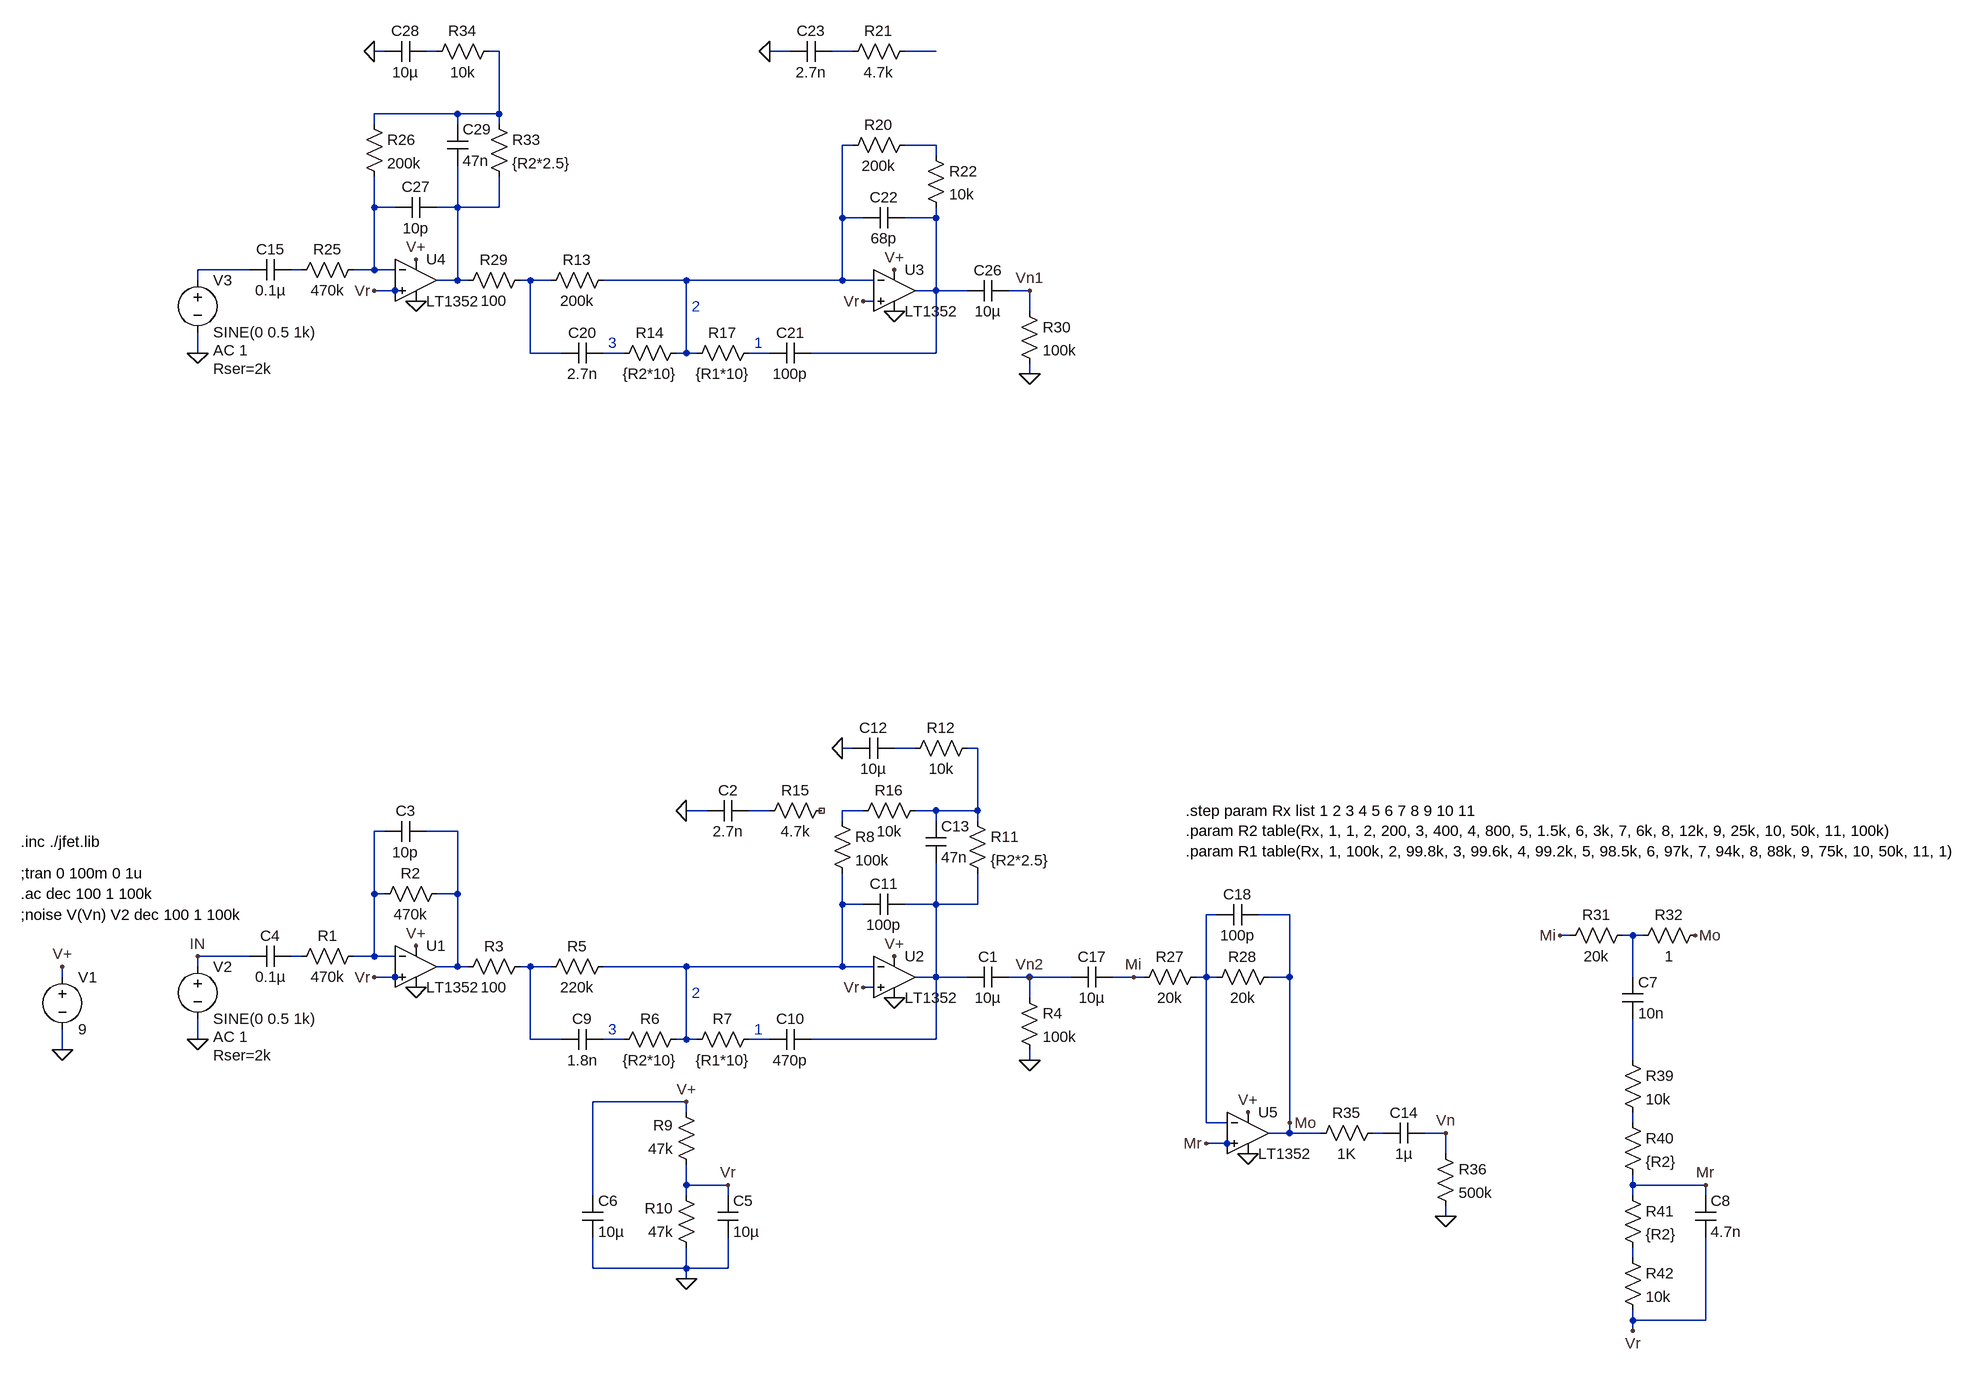
[diagram p0: schematic CB_BGP_V0.asc]
CB_BGP_V0.asc, the LTspice schematic file:
Version 4
SHEET 1 5112 4608
WIRE 880 -1296 864 -1296
WIRE 960 -1296 944 -1296
WIRE 1056 -1296 1040 -1296
WIRE 1504 -1296 1472 -1296
WIRE 1600 -1296 1568 -1296
WIRE 1728 -1296 1680 -1296
WIRE 992 -1200 864 -1200
WIRE 1056 -1200 1056 -1296
WIRE 1056 -1200 992 -1200
WIRE 864 -1184 864 -1200
WIRE 992 -1184 992 -1200
WIRE 1056 -1184 1056 -1200
WIRE 1600 -1152 1584 -1152
WIRE 1728 -1152 1680 -1152
WIRE 1728 -1136 1728 -1152
WIRE 864 -1056 864 -1104
WIRE 896 -1056 864 -1056
WIRE 992 -1056 992 -1120
WIRE 992 -1056 960 -1056
WIRE 1056 -1056 1056 -1104
WIRE 1056 -1056 992 -1056
WIRE 1584 -1040 1584 -1152
WIRE 1616 -1040 1584 -1040
WIRE 1728 -1040 1728 -1056
WIRE 1728 -1040 1680 -1040
WIRE 672 -960 592 -960
WIRE 752 -960 736 -960
WIRE 864 -960 864 -1056
WIRE 864 -960 832 -960
WIRE 896 -960 864 -960
WIRE 592 -944 592 -960
WIRE 992 -944 992 -1056
WIRE 992 -944 960 -944
WIRE 1008 -944 992 -944
WIRE 1104 -944 1088 -944
WIRE 1136 -944 1104 -944
WIRE 1344 -944 1216 -944
WIRE 1584 -944 1584 -1040
WIRE 1584 -944 1344 -944
WIRE 1632 -944 1584 -944
WIRE 896 -928 864 -928
WIRE 912 -928 896 -928
WIRE 1728 -928 1728 -1040
WIRE 1728 -928 1696 -928
WIRE 1776 -928 1728 -928
WIRE 1872 -928 1840 -928
WIRE 1632 -912 1616 -912
WIRE 1872 -896 1872 -928
WIRE 592 -832 592 -864
WIRE 1104 -832 1104 -944
WIRE 1152 -832 1104 -832
WIRE 1248 -832 1216 -832
WIRE 1344 -832 1344 -944
WIRE 1344 -832 1328 -832
WIRE 1360 -832 1344 -832
WIRE 1472 -832 1440 -832
WIRE 1728 -832 1728 -928
WIRE 1728 -832 1536 -832
WIRE 1872 -800 1872 -816
WIRE 1600 -224 1584 -224
WIRE 1696 -224 1664 -224
WIRE 1792 -224 1776 -224
WIRE 1376 -128 1344 -128
WIRE 1472 -128 1440 -128
WIRE 1616 -128 1584 -128
WIRE 1728 -128 1696 -128
WIRE 1792 -128 1792 -224
WIRE 1792 -128 1728 -128
WIRE 1584 -112 1584 -128
WIRE 1728 -112 1728 -128
WIRE 1792 -112 1792 -128
WIRE 880 -96 864 -96
WIRE 992 -96 944 -96
WIRE 864 0 864 -96
WIRE 880 0 864 0
WIRE 992 0 992 -96
WIRE 992 0 960 0
WIRE 1584 16 1584 -32
WIRE 1616 16 1584 16
WIRE 1728 16 1728 -48
WIRE 1728 16 1680 16
WIRE 1792 16 1792 -32
WIRE 1792 16 1728 16
WIRE 2160 32 2144 32
WIRE 2272 32 2224 32
WIRE 2704 64 2688 64
WIRE 2800 64 2784 64
WIRE 2816 64 2800 64
WIRE 672 96 592 96
WIRE 752 96 736 96
WIRE 864 96 864 0
WIRE 864 96 832 96
WIRE 896 96 864 96
WIRE 592 112 592 96
WIRE 992 112 992 0
WIRE 992 112 960 112
WIRE 1008 112 992 112
WIRE 1104 112 1088 112
WIRE 1136 112 1104 112
WIRE 1344 112 1216 112
WIRE 1584 112 1584 16
WIRE 1584 112 1344 112
WIRE 1632 112 1584 112
WIRE 384 128 384 112
WIRE 896 128 864 128
WIRE 912 128 896 128
WIRE 1728 128 1728 16
WIRE 1728 128 1696 128
WIRE 1776 128 1728 128
WIRE 1872 128 1840 128
WIRE 1936 128 1872 128
WIRE 2032 128 2000 128
WIRE 2048 128 2032 128
WIRE 2144 128 2144 32
WIRE 2144 128 2128 128
WIRE 2160 128 2144 128
WIRE 2272 128 2272 32
WIRE 2272 128 2240 128
WIRE 2800 128 2800 64
WIRE 1632 144 1616 144
WIRE 1872 160 1872 128
WIRE 592 224 592 192
WIRE 1104 224 1104 112
WIRE 1152 224 1104 224
WIRE 1248 224 1216 224
WIRE 1344 224 1344 112
WIRE 1344 224 1328 224
WIRE 1360 224 1344 224
WIRE 1472 224 1440 224
WIRE 1728 224 1728 128
WIRE 1728 224 1536 224
WIRE 384 240 384 208
WIRE 1872 256 1872 240
WIRE 2800 256 2800 192
WIRE 1344 320 1200 320
WIRE 1344 336 1344 320
WIRE 2144 352 2144 128
WIRE 2176 352 2144 352
WIRE 2272 352 2272 128
WIRE 2800 352 2800 336
WIRE 2272 368 2272 352
WIRE 2272 368 2240 368
WIRE 2320 368 2272 368
WIRE 2416 368 2400 368
WIRE 2512 368 2480 368
WIRE 2176 384 2144 384
WIRE 2192 384 2176 384
WIRE 2512 400 2512 368
WIRE 1344 448 1344 416
WIRE 1408 448 1344 448
WIRE 2800 448 2800 432
WIRE 2912 448 2800 448
WIRE 1200 464 1200 320
WIRE 1344 464 1344 448
WIRE 1408 464 1408 448
WIRE 2800 464 2800 448
WIRE 2912 464 2912 448
WIRE 2512 496 2512 480
WIRE 2800 560 2800 544
WIRE 1200 576 1200 528
WIRE 1344 576 1344 544
WIRE 1344 576 1200 576
WIRE 1408 576 1408 528
WIRE 1408 576 1344 576
WIRE 1344 592 1344 576
WIRE 2800 656 2800 640
WIRE 2912 656 2912 528
WIRE 2912 656 2800 656
WIRE 2800 672 2800 656
FLAG 592 224 0
FLAG 1664 96 V+
FLAG 2512 496 0
FLAG 2512 368 Vn
FLAG 2208 336 V+
FLAG 384 112 V+
FLAG 384 240 0
FLAG 2144 384 Mr
FLAG 2032 128 Mi
FLAG 2896 64 Mo
FLAG 2688 64 Mi
FLAG 2912 448 Mr
FLAG 2800 672 Vr
FLAG 1664 160 0
FLAG 2208 400 0
FLAG 2272 352 Mo
FLAG 1344 320 V+
FLAG 1344 592 0
FLAG 1408 448 Vr
FLAG 1616 144 Vr
FLAG 1584 -224 0
FLAG 1344 -128 0
FLAG 928 80 V+
FLAG 928 144 0
FLAG 592 96 IN
FLAG 864 128 Vr
FLAG 1872 256 0
FLAG 592 -832 0
FLAG 1664 -960 V+
FLAG 1664 -896 0
FLAG 1616 -912 Vr
FLAG 928 -976 V+
FLAG 928 -912 0
FLAG 864 -928 Vr
FLAG 1872 -800 0
FLAG 864 -1296 0
FLAG 1472 -1296 0
FLAG 1872 -928 Vn1
FLAG 1872 128 Vn2
SYMBOL voltage 384 112 R0
WINDOW 123 0 0 Left 2
WINDOW 39 0 0 Left 2
SYMATTR InstName V1
SYMATTR Value 9
SYMBOL voltage 592 96 R0
WINDOW 123 24 124 Left 2
WINDOW 39 24 152 Left 2
SYMATTR Value2 AC 1
SYMATTR SpiceLine Rser=2k
SYMATTR InstName V2
SYMATTR Value SINE(0 0.5 1k)
SYMBOL cap 736 80 R90
WINDOW 0 0 32 VBottom 2
WINDOW 3 32 32 VTop 2
SYMATTR InstName C4
SYMATTR Value 0.1µ
SYMBOL cap 2480 352 R90
WINDOW 0 0 32 VBottom 2
WINDOW 3 32 32 VTop 2
SYMATTR InstName C14
SYMATTR Value 1µ
SYMBOL res 2416 352 R90
WINDOW 0 0 56 VBottom 2
WINDOW 3 32 56 VTop 2
SYMATTR InstName R35
SYMATTR Value 1K
SYMBOL res 2496 384 R0
SYMATTR InstName R36
SYMATTR Value 500k
SYMBOL res 2144 112 R90
WINDOW 0 0 56 VBottom 2
WINDOW 3 32 56 VTop 2
SYMATTR InstName R27
SYMATTR Value 20k
SYMBOL res 2256 112 R90
WINDOW 0 0 56 VBottom 2
WINDOW 3 32 56 VTop 2
SYMATTR InstName R28
SYMATTR Value 20k
SYMBOL cap 2000 112 R90
WINDOW 0 0 32 VBottom 2
WINDOW 3 32 32 VTop 2
SYMATTR InstName C17
SYMATTR Value 10µ
SYMBOL res 2800 48 R90
WINDOW 0 0 56 VBottom 2
WINDOW 3 32 56 VTop 2
SYMATTR InstName R31
SYMATTR Value 20k
SYMBOL res 2912 48 R90
WINDOW 0 0 56 VBottom 2
WINDOW 3 32 56 VTop 2
SYMATTR InstName R32
SYMATTR Value 1
SYMBOL cap 2784 128 R0
SYMATTR InstName C7
SYMATTR Value 10n
SYMBOL res 2784 240 R0
SYMATTR InstName R39
SYMATTR Value 10k
SYMBOL res 2784 336 R0
SYMATTR InstName R40
SYMATTR Value {R2}
SYMBOL res 2784 448 R0
SYMATTR InstName R41
SYMATTR Value {R2}
SYMBOL res 2784 544 R0
SYMATTR InstName R42
SYMATTR Value 10k
SYMBOL cap 2896 464 R0
SYMATTR InstName C8
SYMATTR Value 4.7n
SYMBOL Opamps\\LT1352 1664 64 R0
SYMATTR InstName U2
SYMBOL Opamps\\LT1352 2208 304 R0
SYMATTR InstName U5
SYMBOL cap 2224 16 R90
WINDOW 0 0 32 VBottom 2
WINDOW 3 32 32 VTop 2
SYMATTR InstName C18
SYMATTR Value 100p
SYMBOL res 1232 96 R90
WINDOW 0 0 56 VBottom 2
WINDOW 3 32 56 VTop 2
SYMATTR InstName R5
SYMATTR Value 220k
SYMBOL res 1344 208 R90
WINDOW 0 0 56 VBottom 2
WINDOW 3 32 56 VTop 2
SYMATTR InstName R6
SYMATTR Value {R2*10}
SYMBOL res 1456 208 R90
WINDOW 0 0 56 VBottom 2
WINDOW 3 32 56 VTop 2
SYMATTR InstName R7
SYMATTR Value {R1*10}
SYMBOL res 1360 432 R180
WINDOW 0 36 76 Left 2
WINDOW 3 36 40 Left 2
SYMATTR InstName R9
SYMATTR Value 47k
SYMBOL res 1360 560 R180
WINDOW 0 36 76 Left 2
WINDOW 3 36 40 Left 2
SYMATTR InstName R10
SYMATTR Value 47k
SYMBOL cap 1392 464 R0
SYMATTR InstName C5
SYMATTR Value 10µ
SYMBOL cap 1184 464 R0
SYMATTR InstName C6
SYMATTR Value 10µ
SYMBOL cap 1216 208 R90
WINDOW 0 0 32 VBottom 2
WINDOW 3 32 32 VTop 2
SYMATTR InstName C9
SYMATTR Value 1.8n
SYMBOL cap 1536 208 R90
WINDOW 0 0 32 VBottom 2
WINDOW 3 32 32 VTop 2
SYMATTR InstName C10
SYMATTR Value 470p
SYMBOL cap 1680 0 R90
WINDOW 0 0 32 VBottom 2
WINDOW 3 32 32 VTop 2
SYMATTR InstName C11
SYMATTR Value 100p
SYMBOL res 1568 -128 R0
SYMATTR InstName R8
SYMATTR Value 100k
SYMBOL res 1776 -128 R0
SYMATTR InstName R11
SYMATTR Value {R2*2.5}
SYMBOL res 1792 -240 R90
WINDOW 0 0 56 VBottom 2
WINDOW 3 32 56 VTop 2
SYMATTR InstName R12
SYMATTR Value 10k
SYMBOL cap 1664 -240 R90
WINDOW 0 0 32 VBottom 2
WINDOW 3 32 32 VTop 2
SYMATTR InstName C12
SYMATTR Value 10µ
SYMBOL cap 1712 -112 R0
SYMATTR InstName C13
SYMATTR Value 47n
SYMBOL res 1568 -144 R90
WINDOW 0 0 56 VBottom 2
WINDOW 3 32 56 VTop 2
SYMATTR InstName R15
SYMATTR Value 4.7k
SYMBOL cap 1440 -144 R90
WINDOW 0 0 32 VBottom 2
WINDOW 3 32 32 VTop 2
SYMATTR InstName C2
SYMATTR Value 2.7n
SYMBOL res 1712 -144 R90
WINDOW 0 0 56 VBottom 2
WINDOW 3 32 56 VTop 2
SYMATTR InstName R16
SYMATTR Value 10k
SYMBOL res 848 80 R90
WINDOW 0 0 56 VBottom 2
WINDOW 3 32 56 VTop 2
SYMATTR InstName R1
SYMATTR Value 470k
SYMBOL res 976 -16 R90
WINDOW 0 0 56 VBottom 2
WINDOW 3 32 56 VTop 2
SYMATTR InstName R2
SYMATTR Value 470k
SYMBOL Opamps\\LT1352 928 48 R0
SYMATTR InstName U1
SYMBOL res 1104 96 R90
WINDOW 0 0 56 VBottom 2
WINDOW 3 32 56 VTop 2
SYMATTR InstName R3
SYMATTR Value 100
SYMBOL res 1856 144 R0
SYMATTR InstName R4
SYMATTR Value 100k
SYMBOL cap 1840 112 R90
WINDOW 0 0 32 VBottom 2
WINDOW 3 32 32 VTop 2
SYMATTR InstName C1
SYMATTR Value 10µ
SYMBOL cap 944 -112 R90
WINDOW 0 0 32 VBottom 2
WINDOW 3 32 32 VTop 2
SYMATTR InstName C3
SYMATTR Value 10p
SYMBOL voltage 592 -960 R0
WINDOW 123 24 124 Left 2
WINDOW 39 24 152 Left 2
SYMATTR Value2 AC 1
SYMATTR SpiceLine Rser=2k
SYMATTR InstName V3
SYMATTR Value SINE(0 0.5 1k)
SYMBOL cap 736 -976 R90
WINDOW 0 0 32 VBottom 2
WINDOW 3 32 32 VTop 2
SYMATTR InstName C15
SYMATTR Value 0.1µ
SYMBOL Opamps\\LT1352 1664 -992 R0
SYMATTR InstName U3
SYMBOL res 1232 -960 R90
WINDOW 0 0 56 VBottom 2
WINDOW 3 32 56 VTop 2
SYMATTR InstName R13
SYMATTR Value 200k
SYMBOL res 1344 -848 R90
WINDOW 0 0 56 VBottom 2
WINDOW 3 32 56 VTop 2
SYMATTR InstName R14
SYMATTR Value {R2*10}
SYMBOL res 1456 -848 R90
WINDOW 0 0 56 VBottom 2
WINDOW 3 32 56 VTop 2
SYMATTR InstName R17
SYMATTR Value {R1*10}
SYMBOL cap 1216 -848 R90
WINDOW 0 0 32 VBottom 2
WINDOW 3 32 32 VTop 2
SYMATTR InstName C20
SYMATTR Value 2.7n
SYMBOL cap 1536 -848 R90
WINDOW 0 0 32 VBottom 2
WINDOW 3 32 32 VTop 2
SYMATTR InstName C21
SYMATTR Value 100p
SYMBOL res 848 -976 R90
WINDOW 0 0 56 VBottom 2
WINDOW 3 32 56 VTop 2
SYMATTR InstName R25
SYMATTR Value 470k
SYMBOL Opamps\\LT1352 928 -1008 R0
SYMATTR InstName U4
SYMBOL res 1104 -960 R90
WINDOW 0 0 56 VBottom 2
WINDOW 3 32 56 VTop 2
SYMATTR InstName R29
SYMATTR Value 100
SYMBOL res 1856 -912 R0
SYMATTR InstName R30
SYMATTR Value 100k
SYMBOL cap 1840 -944 R90
WINDOW 0 0 32 VBottom 2
WINDOW 3 32 32 VTop 2
SYMATTR InstName C26
SYMATTR Value 10µ
SYMBOL cap 960 -1072 R90
WINDOW 0 0 32 VBottom 2
WINDOW 3 32 32 VTop 2
SYMATTR InstName C27
SYMATTR Value 10p
SYMBOL res 848 -1200 R0
SYMATTR InstName R26
SYMATTR Value 200k
SYMBOL res 1040 -1200 R0
SYMATTR InstName R33
SYMATTR Value {R2*2.5}
SYMBOL res 1056 -1312 R90
WINDOW 0 0 56 VBottom 2
WINDOW 3 32 56 VTop 2
SYMATTR InstName R34
SYMATTR Value 10k
SYMBOL cap 944 -1312 R90
WINDOW 0 0 32 VBottom 2
WINDOW 3 32 32 VTop 2
SYMATTR InstName C28
SYMATTR Value 10µ
SYMBOL cap 976 -1184 R0
SYMATTR InstName C29
SYMATTR Value 47n
SYMBOL cap 1680 -1056 R90
WINDOW 0 0 32 VBottom 2
WINDOW 3 32 32 VTop 2
SYMATTR InstName C22
SYMATTR Value 68p
SYMBOL res 1696 -1168 R90
WINDOW 0 0 56 VBottom 2
WINDOW 3 32 56 VTop 2
SYMATTR InstName R20
SYMATTR Value 200k
SYMBOL res 1696 -1312 R90
WINDOW 0 0 56 VBottom 2
WINDOW 3 32 56 VTop 2
SYMATTR InstName R21
SYMATTR Value 4.7k
SYMBOL cap 1568 -1312 R90
WINDOW 0 0 32 VBottom 2
WINDOW 3 32 32 VTop 2
SYMATTR InstName C23
SYMATTR Value 2.7n
SYMBOL res 1712 -1152 R0
SYMATTR InstName R22
SYMATTR Value 10k
TEXT 320 -80 Left 2 !.inc ./jfet.lib
TEXT 320 -32 Left 2 !;tran 0 100m 0 1u
TEXT 320 0 Left 2 !.ac dec 100 1 100k
TEXT 2112 -128 Left 2 !.step param Rx list 1 2 3 4 5 6 7 8 9 10 11\n.param R2 table(Rx, 1, 1, 2, 200, 3, 400, 4, 800, 5, 1.5k, 6, 3k, 7, 6k, 8, 12k, 9, 25k, 10, 50k, 11, 100k)\n.param R1 table(Rx, 1, 100k, 2, 99.8k, 3, 99.6k, 4, 99.2k, 5, 98.5k, 6, 97k, 7, 94k, 8, 88k, 9, 75k, 10, 50k, 11, 1)
TEXT 320 32 Left 2 !;noise V(Vn) V2 dec 100 1 100k
TEXT 1224 208 Left 2 ;3
TEXT 1352 152 Left 2 ;2
TEXT 1448 208 Left 2 ;1
TEXT 1224 -848 Left 2 ;3
TEXT 1352 -904 Left 2 ;2
TEXT 1448 -848 Left 2 ;1

The netlist it stands for:
* CB_BGP_V0.asc
V1 V+ 0 9
V2 IN 0 SINE(0 0.5 1k) AC 1 Rser=2k
C4 N025 IN 0.1µ
C14 Vn N031 1µ
R35 N031 Mo 1K
R36 Vn 0 500k
R27 N023 Mi 20k
R28 Mo N023 20k
C17 Mi Vn2 10µ
R31 N024 Mi 20k
R32 Mo N024 1
C7 N024 N029 10n
R39 N029 N030 10k
R40 N030 Mr {R2}
R41 Mr N032 {R2}
R42 N032 Vr 10k
C8 Mr Vr 4.7n
XU2 Vr N021 V+ 0 N022 LT1352  ; pins In+ In- V+ V- OUT
XU5 Mr N023 V+ 0 Mo LT1352  ; pins In+ In- V+ V- OUT
C18 Mo N023 100p
R5 N021 N026 220k
R6 N021 N027 {R2*10}
R7 N028 N021 {R1*10}
R9 Vr V+ 47k
R10 0 Vr 47k
C5 Vr 0 10µ
C6 V+ 0 10µ
C9 N027 N026 1.8n
C10 N022 N028 470p
C11 N022 N021 100p
R8 N018 N021 100k
R11 N016 N022 {R2*2.5}
R12 N016 N015 10k
C12 N015 0 10µ
C13 N016 N022 47n
R15 NC_01 N017 4.7k
C2 N017 0 2.7n
R16 N016 N018 10k
R1 N019 N025 470k
R2 N020 N019 470k
XU1 Vr N019 V+ 0 N020 LT1352  ; pins In+ In- V+ V- OUT
R3 N026 N020 100
R4 Vn2 0 100k
C1 Vn2 N022 10µ
C3 N020 N019 10p
V3 N010 0 SINE(0 0.5 1k) AC 1 Rser=2k
C15 N011 N010 0.1µ
XU3 Vr N005 V+ 0 N009 LT1352  ; pins In+ In- V+ V- OUT
R13 N005 N012 200k
R14 N005 N013 {R2*10}
R17 N014 N005 {R1*10}
C20 N013 N012 2.7n
C21 N009 N014 100p
R25 N007 N011 470k
XU4 Vr N007 V+ 0 N008 LT1352  ; pins In+ In- V+ V- OUT
R29 N012 N008 100
R30 Vn1 0 100k
C26 Vn1 N009 10µ
C27 N008 N007 10p
R26 N002 N007 200k
R33 N002 N008 {R2*2.5}
R34 N002 N001 10k
C28 N001 0 10µ
C29 N002 N008 47n
C22 N009 N005 68p
R20 N006 N005 200k
R21 N004 N003 4.7k
C23 N003 0 2.7n
R22 N006 N009 10k
.inc ./jfet.lib
;tran 0 100m 0 1u
.ac dec 100 1 100k
.step param Rx list 1 2 3 4 5 6 7 8 9 10 11
.param R2 table(Rx, 1, 1, 2, 200, 3, 400, 4, 800, 5, 1.5k, 6, 3k, 7, 6k, 8, 12k, 9, 25k, 10, 50k, 11, 100k)
.param R1 table(Rx, 1, 100k, 2, 99.8k, 3, 99.6k, 4, 99.2k, 5, 98.5k, 6, 97k, 7, 94k, 8, 88k, 9, 75k, 10, 50k, 11, 1)
;noise V(Vn) V2 dec 100 1 100k
* 3
* 2
* 1
* 3
* 2
* 1
.lib LTC.lib
.backanno
.end